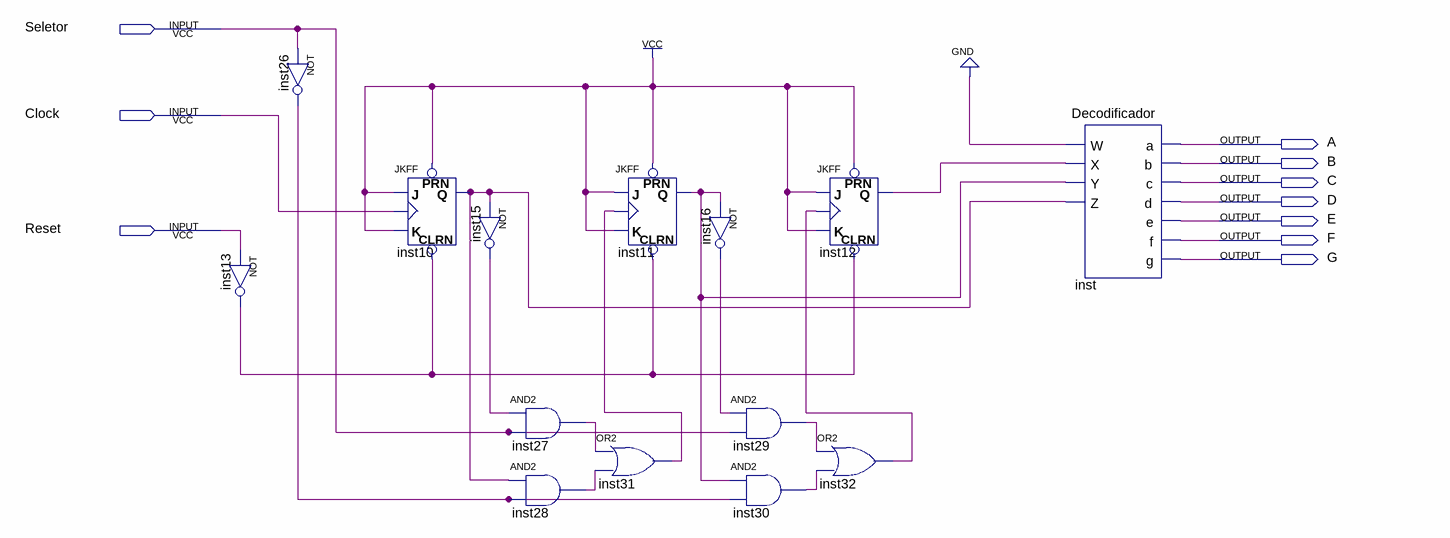
[diagram p0: schematic sheet]
// Quartus schematic ContAsyncAscDesc.bdf as structural Verilog: 14 symbols, 10 pins
module ContAsyncAscDesc (
  input  Seletor,
  input  Clock,
  input  Reset,
  output A,
  output B,
  output C,
  output D,
  output E,
  output F,
  output G
);

  wire inst10_q, inst11_q, inst12_q, inst13_out, inst15_out, inst16_out, inst26_out, inst27_out, inst28_out,
       inst29_out, inst30_out, inst31_out, inst32_out;

  not inst13 (inst13_out, Reset);
  not inst26 (inst26_out, Seletor);
  JKFF inst10 (.PRN(1'b1), .CLRN(inst13_out), .K(1'b1), .J(1'b1), .CLK(Clock), .Q(inst10_q));
  not inst15 (inst15_out, inst10_q);
  and inst27 (inst27_out, inst15_out, Seletor);
  and inst28 (inst28_out, inst10_q, inst26_out);
  JKFF inst11 (.PRN(1'b1), .CLRN(inst13_out), .K(1'b1), .J(1'b1), .CLK(inst31_out), .Q(inst11_q));
  or inst31 (inst31_out, inst27_out, inst28_out);
  not inst16 (inst16_out, inst11_q);
  and inst29 (inst29_out, inst16_out, Seletor);
  and inst30 (inst30_out, inst11_q, inst26_out);
  JKFF inst12 (.PRN(1'b1), .CLRN(inst13_out), .K(1'b1), .J(1'b1), .CLK(inst32_out), .Q(inst12_q));
  or inst32 (inst32_out, inst29_out, inst30_out);
  Decodificador inst (
    .W(1'b0), .X(inst12_q), .Y(inst11_q), .Z(inst10_q), .a(A), .b(B), .c(C), .d(D), .e(E), .f(F), .g(G));
endmodule
